# EAGLE schematic Main_Electronics_B (EAGLE 8.4.1)
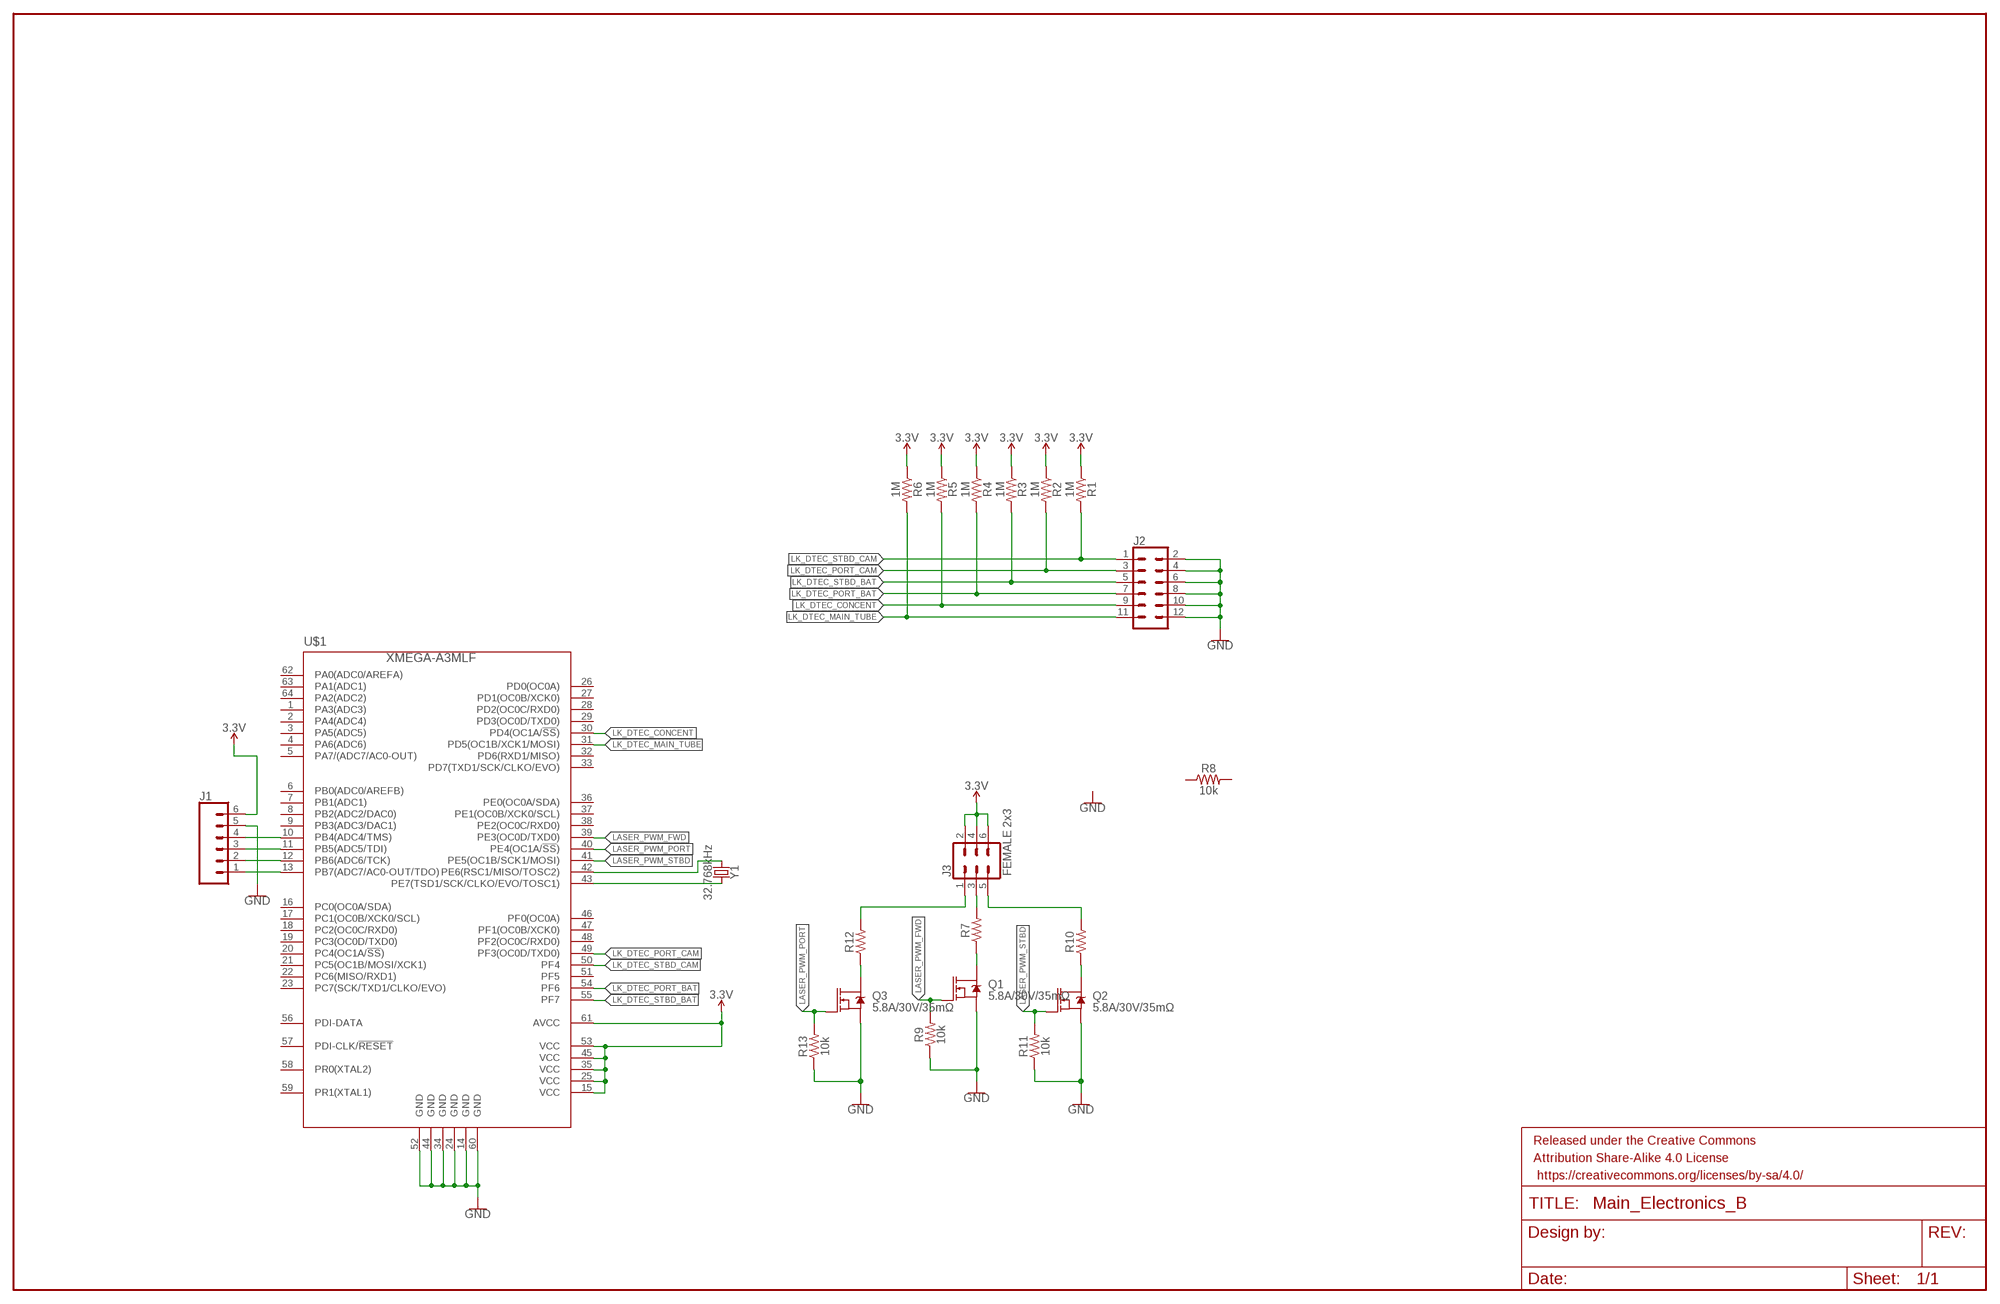
[diagram p0: schematic, sheet 1]

## Parts
FRAME1  FRAME-LEDGER  [CREATIVE_COMMONS]
J1  CONN_06NO_SILK_NO_POP  [1X06_NO_SILK]
J2  CONN_06X2NO_SILK  [2X6_NOSILK]
J3  FEMALE 2x3  CONN_03X2FEMALE  [2X3]
Q1  5.8A/30V/35mΩ  MOSFET-NCH-AO3404A  [SOT23-3]
Q2  5.8A/30V/35mΩ  MOSFET-NCH-AO3404A  [SOT23-3]
Q3  5.8A/30V/35mΩ  MOSFET-NCH-AO3404A  [SOT23-3]
R1  1M  1MOHM-0603-1/4W-5%  [0603]
R2  1M  1MOHM-0603-1/4W-5%  [0603]
R3  1M  1MOHM-0603-1/4W-5%  [0603]
R4  1M  1MOHM-0603-1/4W-5%  [0603]
R5  1M  1MOHM-0603-1/4W-5%  [0603]
R6  1M  1MOHM-0603-1/4W-5%  [0603]
R7  RESISTOR0603  [0603]
R8  10k  10KOHM-0603-1/10W-1%  [0603]
R9  10k  10KOHM-0603-1/10W-1%  [0603]
R10  RESISTOR0603  [0603]
R11  10k  10KOHM-0603-1/10W-1%  [0603]
R12  RESISTOR0603  [0603]
R13  10k  10KOHM-0603-1/10W-1%  [0603]
U$1  XMEGA-A3MLF  [MLF64]
Y1  32.768kHz  CRYSTAL-32.768KHZPTH-2X6-KIT  [CRYSTAL-PTH-2X6-CYL-KIT]

## Nets
3.3V: J1.6 J3.2 J3.4 J3.6 R1.1 R2.1 R3.1 R4.1 R5.1 R6.1 U$1.15(VCC) U$1.25(VCC) U$1.35(VCC) U$1.45(VCC) U$1.53(VCC) U$1.61(AVCC)
GND: J1.5 J2.2 J2.4 J2.6 J2.8 J2.10 J2.12 Q1.2(S) Q2.2(S) Q3.2(S) R9.1 R11.1 R13.1 U$1.14(GND) U$1.24(GND) U$1.34(GND) U$1.44(GND) U$1.52(GND) U$1.60(GND)
LASER_PWM_FWD: Q1.1(G) R9.2 U$1.39(PE3(OC0D/TXD0))
LASER_PWM_PORT: Q3.1(G) R13.2 U$1.40(PE4(OC1A/!SS!))
LASER_PWM_STBD: Q2.1(G) R11.2 U$1.41(PE5(OC1B/SCK1/MOSI))
LK_DTEC_CONCENT: J2.9 R5.2 U$1.30(PD4(OC1A/!SS!))
LK_DTEC_MAIN_TUBE: J2.11 R6.2 U$1.31(PD5(OC1B/XCK1/MOSI))
LK_DTEC_PORT_BAT: J2.7 R4.2 U$1.54(PF6)
LK_DTEC_PORT_CAM: J2.3 R2.2 U$1.49(PF3(OC0D/TXD0))
LK_DTEC_STBD_BAT: J2.5 R3.2 U$1.55(PF7)
LK_DTEC_STBD_CAM: J2.1 R1.2 U$1.50(PF4)
N$1: J1.1 U$1.13(PB7(ADC7/AC0-OUT/TDO))
N$2: J1.2 U$1.12(PB6(ADC6/TCK))
N$3: J1.3 U$1.11(PB5(ADC5/TDI))
N$4: J1.4 U$1.10(PB4(ADC4/TMS))
N$5: U$1.43(PE7(TSD1/SCK/CLKO/EVO/TOSC1)) Y1.2
N$6: U$1.42(PE6(RSC1/MISO/TOSC2)) Y1.1
N$7: J3.3 R7.2
N$8: Q1.3(D) R7.1
N$11: Q2.3(D) R10.1
N$12: J3.5 R10.2
N$13: Q3.3(D) R12.1
N$14: J3.1 R12.2
Unconnected: R8.1 R8.2 U$1.1(PA3(ADC3)) U$1.2(PA4(ADC4)) U$1.3(PA5(ADC5)) U$1.4(PA6(ADC6)) U$1.5(PA7/(ADC7/AC0-OUT)) U$1.6(PB0(ADC0/AREFB)) U$1.7(PB1(ADC1)) U$1.8(PB2(ADC2/DAC0)) U$1.9(PB3(ADC3/DAC1)) U$1.16(PC0(OC0A/SDA)) U$1.17(PC1(OC0B/XCK0/SCL)) U$1.18(PC2(OC0C/RXD0)) U$1.19(PC3(OC0D/TXD0)) U$1.20(PC4(OC1A/!SS!)) U$1.21(PC5(OC1B/MOSI/XCK1)) U$1.22(PC6(MISO/RXD1)) U$1.23(PC7(SCK/TXD1/CLKO/EVO)) U$1.26(PD0(OC0A)) U$1.27(PD1(OC0B/XCK0)) U$1.28(PD2(OC0C/RXD0)) U$1.29(PD3(OC0D/TXD0)) U$1.32(PD6(RXD1/MISO)) U$1.33(PD7(TXD1/SCK/CLKO/EVO)) U$1.36(PE0(OC0A/SDA)) U$1.37(PE1(OC0B/XCK0/SCL)) U$1.38(PE2(OC0C/RXD0)) U$1.46(PF0(OC0A)) U$1.47(PF1(OC0B/XCK0)) U$1.48(PF2(OC0C/RXD0)) U$1.51(PF5) U$1.56(PDI-DATA) U$1.57(PDI-CLK/!RESET) U$1.58(PR0(XTAL2)) U$1.59(PR1(XTAL1)) U$1.62(PA0(ADC0/AREFA)) U$1.63(PA1(ADC1)) U$1.64(PA2(ADC2))

## Library data of the parts
FRAME1 = SparkFun-Aesthetics:FRAME-LEDGER: Schematic Frame - Ledger Standard 11x14 US Ledger frame
J1 = SparkFun-Connectors:CONN_06: Multi connection point. Often used as Generic Header-pin footprint for 0.1 inch spaced/style header connections On any of the 0.1 inch spaced packages, you can populate with these: Break Away Headers - Straight <https://www.sparkfun.com/products/116> (PRT-00116) Break Away Male Headers - Right Angle <https://www.sparkfun.com/products/553> (PRT-00553) Female Headers <https://www.sparkfun.com/products/115> (PRT-00115) Break Away Headers - Machine Pin <https://www.sparkfun.com/products/117> (PRT-00117) Break Away Female Headers - Swiss Machine Pin <https://www.sparkfun.com/products/743> (PRT-00743) Arduino Stackable Header - 6 Pin <https://www.sparkfun.com/products/9280> (PRT-09280) For SCREWTERMINALS and SPRING TERMINALS visit here: Screw Terimnals on SparkFun.com <https://www.sparkfun.com/search/results?term=Screw+Terminals> (5mm/3.5mm/2.54mm spacing) This device is also useful as a general connection point to wire up your design to another part of your project. Our various solder wires solder well into these plated through hole pads. Hook-Up Wire - Assortment (Stranded, 22 AWG) <https://www.sparkfun.com/products/11375> (PRT-11375) Hook-Up Wire - Assortment (Solid Core, 22 AWG) <https://www.sparkfun.com/products/11367> (PRT-11367) View the entire wire category on our website here <https://www.sparkfun.com/categories/141>
J2 = SparkFun-Connectors:CONN_06X2: Multi connection point. Often used as Generic Header-pin footprint for 0.1 inch spaced/style header connections On any of the 0.1 inch spaced packages, you can populate with these: Break Away Headers - Straight <https://www.sparkfun.com/products/116> (PRT-00116) Break Away Male Headers - Right Angle <https://www.sparkfun.com/products/553> (PRT-00553) Female Headers <https://www.sparkfun.com/products/115> (PRT-00115) Break Away Headers - Machine Pin <https://www.sparkfun.com/products/117> (PRT-00117) Break Away Female Headers - Swiss Machine Pin <https://www.sparkfun.com/products/743> (PRT-00743)
J3 = SparkFun-Connectors:CONN_03X2: Multi connection point. Often used as Generic Header-pin footprint for 0.1 inch spaced/style header connections You can populate with any combo of single row headers, but if you'd like an exact match, check these: Header - 2x3 (Male, 0.1") <https://www.sparkfun.com/products/12807> (PRT-12807) Header - 2x3 (Female, 0.1") <https://www.sparkfun.com/products/13010> (PRT-13010) 2x3 Pin Shrouded Header <https://www.sparkfun.com/products/10877> (PRT-10877) On any of the 0.1 inch spaced packages, you can populate with these: Break Away Headers - Straight <https://www.sparkfun.com/products/116> (PRT-00116) Break Away Male Headers - Right Angle <https://www.sparkfun.com/products/553> (PRT-00553) Female Headers <https://www.sparkfun.com/products/115> (PRT-00115) Break Away Headers - Machine Pin <https://www.sparkfun.com/products/117> (PRT-00117) Break Away Female Headers - Swiss Machine Pin <https://www.sparkfun.com/products/743> (PRT-00743) Special note: the shrouded connector mates well with our 3x2 ribbon cables: Ribbon Crimp Connector - 6-pin (2x3, Female) <https://www.sparkfun.com/products/10651> (PRT-10651) Ribbon Cable - 6 wire (15ft) <https://www.sparkfun.com/products/10646> (PRT-10646); PROD_ID: CONN-11566
Q1-Q3 = SparkFun-DiscreteSemi:MOSFET-NCH: N-channel MOSFETs Voltage controlled devices that allow control of high current outputs. SparkFun Products: SparkFun OpenScale <https://www.sparkfun.com/products/13261> SparkFun Digital Sandbox <https://www.sparkfun.com/products/12651> SparkFun Monster Moto Shield <https://www.sparkfun.com/products/10182> SparkFun MOSFET Power Controller <https://www.sparkfun.com/products/11214>; PROD_ID: TRANS-12988
R1-R6 = SparkFun-Resistors:1MOHM: 1MΩ resistor A resistor is a passive two-terminal electrical component that implements electrical resistance as a circuit element. Resistors act to reduce current flow, and, at the same time, act to lower voltage levels within circuits. - Wikipedia; PROD_ID: RES-07868
R7 R10 R12 = SparkFun-Resistors:RESISTOR: Generic Resistor Package
R8 R9 R11 R13 = SparkFun-Resistors:10KOHM: 10kΩ resistor A resistor is a passive two-terminal electrical component that implements electrical resistance as a circuit element. Resistors act to reduce current flow, and, at the same time, act to lower voltage levels within circuits. - Wikipedia; PROD_ID: RES-00824
U$1 = avr-7:XMEGA-A3: Atmel XMega A3 series processor
Y1 = SparkFun-Clocks:CRYSTAL-32.768KHZ: 32.768kHz Crystal Frequency: 32.768kHz Frequency Stability: ±20ppm Load Capacitance: 12.5pF (PTH-2X6 & SMD-3.2X1.5), 6pF (SMD-2X6) SparkFun Products: SparkFun BigTime Watch Kit <https://www.sparkfun.com/products/11734> SparkFun nRF52832 Breakout <https://www.sparkfun.com/products/13990> SparkFun Real Time Clock Module <https://www.sparkfun.com/products/12708>; PROD_ID: XTAL-10112